# Altium schematic sheet 02_BANDPASS.SchDoc
size A3; SheetNumber: 2; SheetTotal: 6
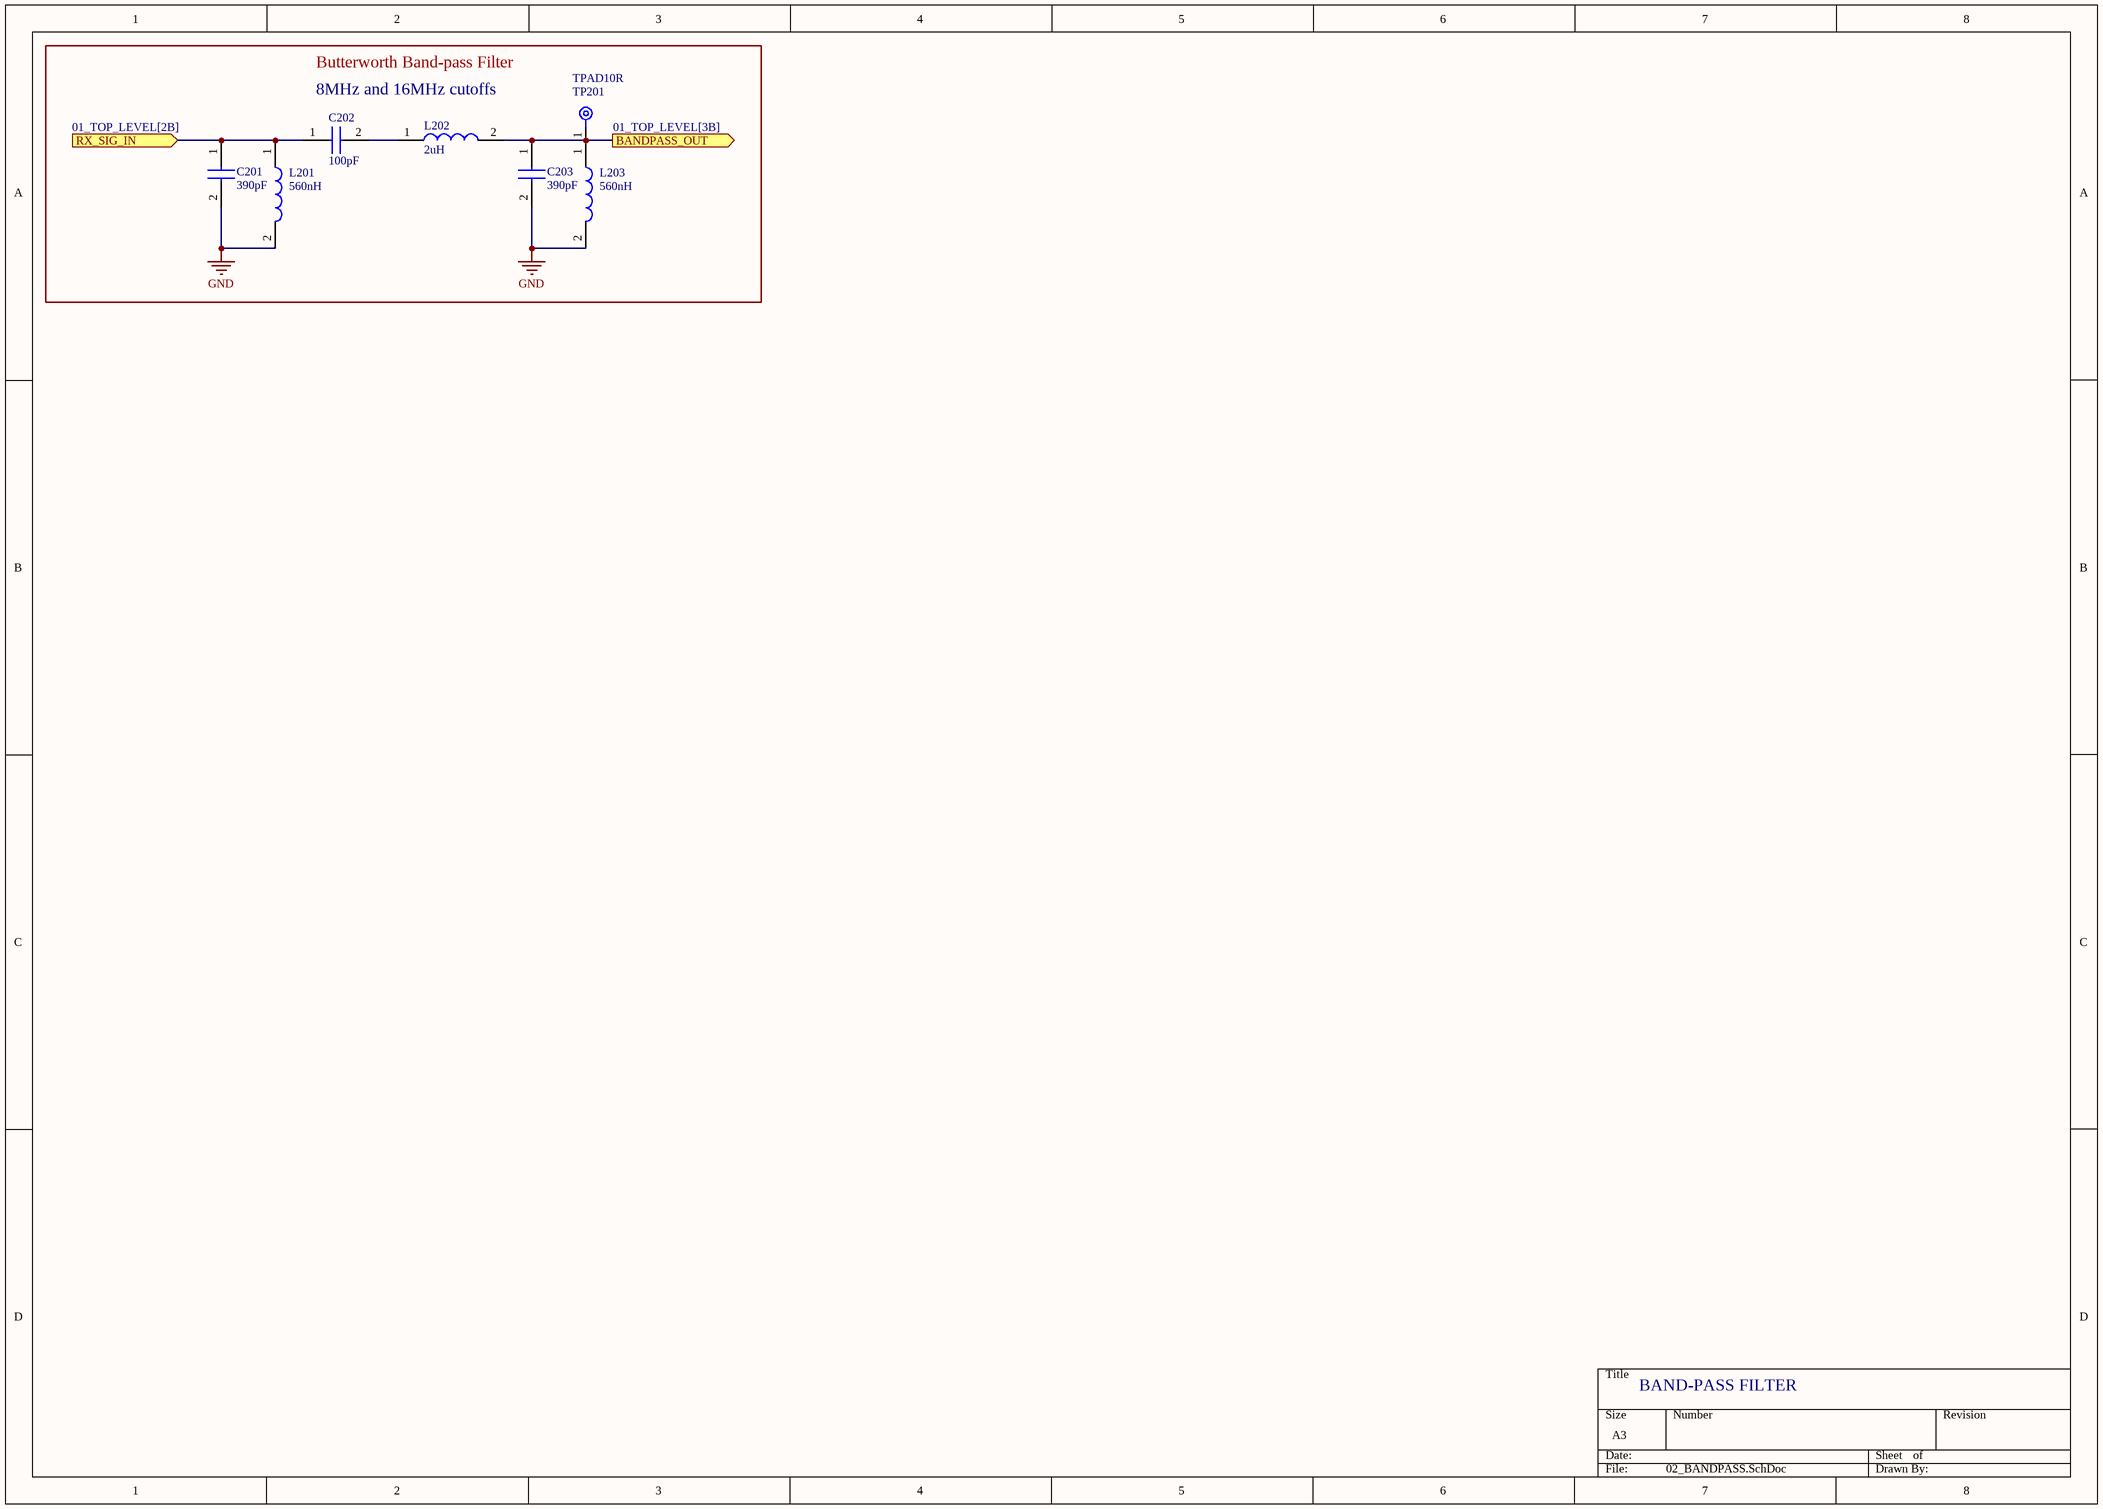
[diagram p0: 02_BANDPASS.SchDoc]

## Parts
C201  390pF  [CAP_0805]
C202  100pF  [CAP_0805]
C203  390pF  [CAP_0805]
L201  560nH  [IND_0805]
L202  2uH  [IND_0805]
L203  560nH  [IND_0805]
TP201  TPAD10R  [TEST_POINT]

## Ports
BANDPASS_OUT (out, see 01_TOP_LEVEL[3B]), RX_SIG_IN (in, see 01_TOP_LEVEL[2B])

## Nets
GND: C201.2 C203.2 L201.2 L203.2
BANDPASS_OUT: C203.1 L202.2 L203.1 TP201.1 ; port BANDPASS_OUT
RX_SIG_IN: C201.1 C202.1 L201.1 ; port RX_SIG_IN
NetC202_2: C202.2 L202.1

## Notes on the sheet
- Butterworth Band-pass Filter
- 8MHz and 16MHz cutoffs
- BAND-PASS FILTER

## Library data of the parts
C201-C203 = CAP_0805: Capacitor SMD 0805; Height: 0.94mm
L201-L203 = IND_0805: Inductor SMD 0805; Manufacturer_Name: Wurth Elektronik; Manufacturer_Part_Number: 74479775147; Height: 1mm; Mouser Part Number: 710-74479775147; Mouser Price/Stock: https://www.mouser.co.uk/ProductDetail/Wurth-Elektronik/74479775147?qs=2kOmHSv6VfSUJsdJ31GFMQ%3D%3D
TP201 = TEST_POINT: Testpont Pad 10R